# EAGLE design EM4095_base_circuit (EAGLE 7.5.0)
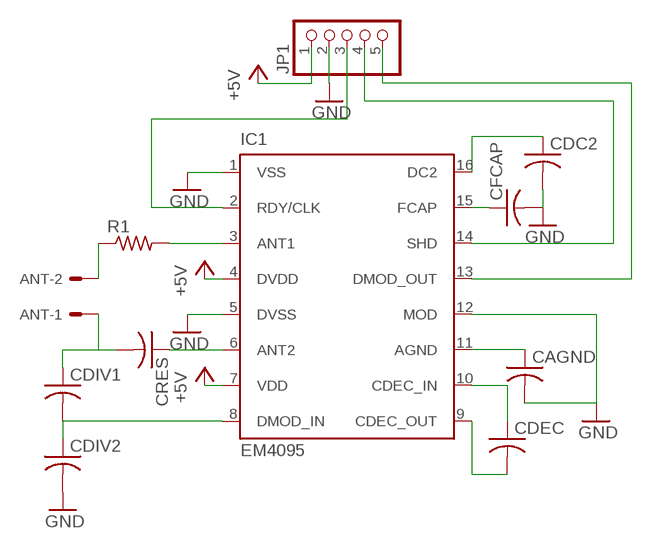
[diagram p0: schematic, sheet 1]

## Parts
ANT  KK-156-2  [KK-156-2]
CAGND  C-USC1206K  [C1206K]
CDC2  C-USC1206K  [C1206K]
CDEC  C-USC1206K  [C1206K]
CDIV1  C-USC1206K  [C1206K]
CDIV2  C-USC1206K  [C1206K]
CFCAP  C-USC1206K  [C1206K]
CRES  C-USC1206K  [C1206K]
IC1  EM4095  [SO16]
JP1  PINHD-1X5  [1X05]
R1  R-US_R1206  [R1206]

## Nets
+5V: IC1.4(DVDD) IC1.7(VDD) JP1.1
DMOD: IC1.13(DMOD_OUT) JP1.5
GND: CAGND.2 CDC2.2 CDIV2.2 CFCAP.2 IC1.1(VSS) IC1.5(DVSS) IC1.12(MOD) JP1.2
N$1: CFCAP.1 IC1.15(FCAP)
N$2: CAGND.1 IC1.11(AGND)
N$3: CRES.1 IC1.6(ANT2)
N$4: CDIV1.2 CDIV2.1 IC1.8(DMOD_IN)
N$5: ANT.1 CDIV1.1 CRES.2
N$6: ANT.2 R1.1
N$7: IC1.3(ANT1) R1.2
N$8: CDC2.1 IC1.16(DC2)
N$11: CDEC.2 IC1.9(CDEC_OUT)
N$12: CDEC.1 IC1.10(CDEC_IN)
RDY: IC1.2(RDY/CLK) JP1.3
SLP: IC1.14(SHD) JP1.4

## Library data of the parts
ANT = con-molex:KK-156-2: KK 156 HEADER Source: http://www.molex.com/pdm_docs/sd/026604100_sd.pdf; OC_FARNELL: unknown; OC_NEWARK: unknown
CAGND CDC2 CDEC CDIV1 CDIV2 CFCAP CRES = rcl:C-US: CAPACITOR, American symbol
IC1 = em-microelectronic:EM4095: Read/Write analog front end for 125kHz RFID Basestation Source: http://www.emmicroelectronic.com/webfiles/Product/RFID/DS/EM4095_DS.pdf
JP1 = pinhead:PINHD-1X5: PIN HEADER
R1 = rcl:R-US_: RESISTOR, American symbol

## Board
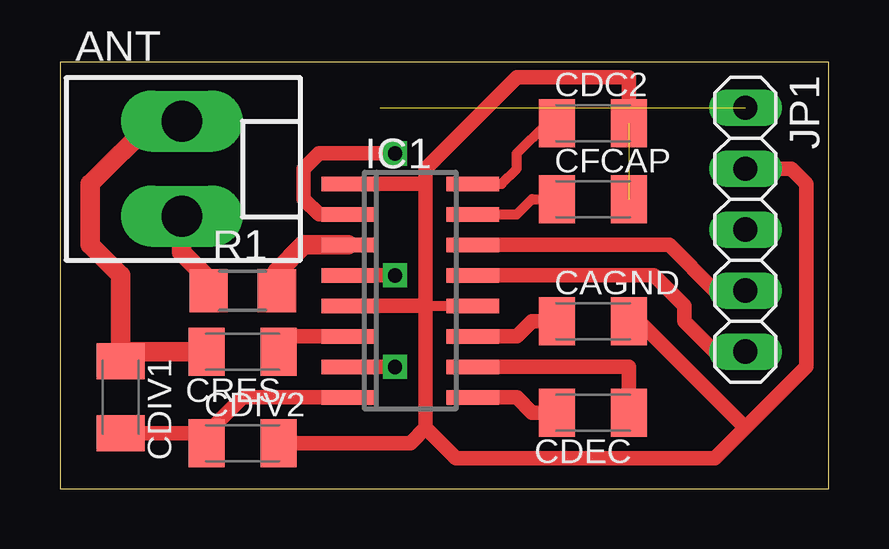
[diagram p1: board, top side]
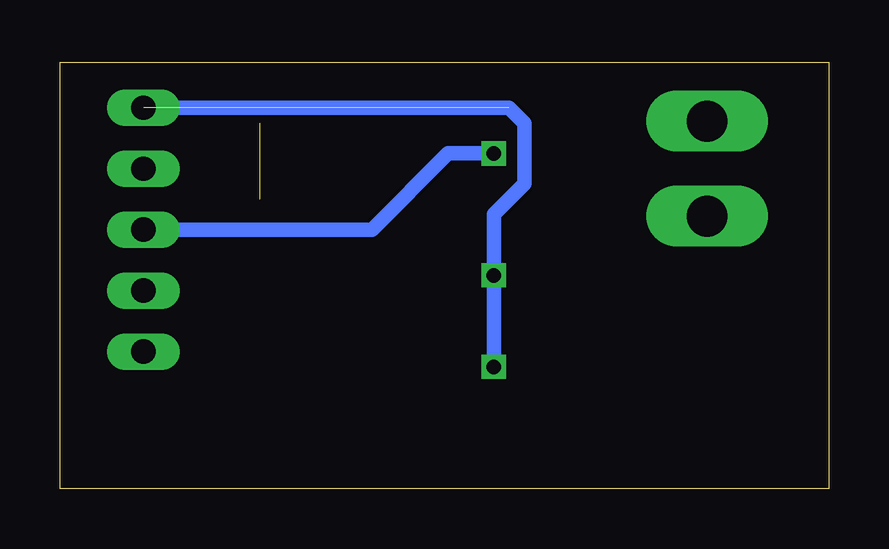
[diagram p2: board, bottom side, seen from below]

Size 32.05 x 17.77 mm. Coordinates in mm from the lower left corner, seen from the top.
Outline: 0,0 32.05,0 32.05,17.77 0,17.77 0,0
Copper layers (1*16): Top 0.035mm / dielectric 1.5mm / Bottom 0.035mm
Design rules "default": minimum track width 10mil, minimum drill 24mil, track to track 8mil, track to pad 8mil, pad to pad 8mil, via to via 8mil, smd to smd 8mil, copper to edge 40mil, drill to drill 8mil, minimum pad ring 10mil, minimum via ring 8mil, stop-mask expansion 4mil, vias tented up to drill 0mil, thermal gap 10mil

### Footprints (pad centres in the part's own frame; a part is rotated, then mirrored left to right if it is on the bottom)
KK-156-2 = drill 1.7 pad 2.184 long: 1 -1.98,0; 2 1.98,0
C1206K = smd 1.5 x 2: 1 -1.5,0; 2 1.5,0
SO16 = smd 0.6 x 2.2: 1 -4.445,-2.6; 2 -3.175,-2.6; 3 -1.905,-2.6; 4 -0.635,-2.6; 5 0.635,-2.6; 6 1.905,-2.6; 7 3.175,-2.6; 8 4.445,-2.6; 9 4.445,2.6; 10 3.175,2.6; 11 1.905,2.6; 12 0.635,2.6; 13 -0.635,2.6; 14 -1.905,2.6; 15 -3.175,2.6; 16 -4.445,2.6
1X05 = drill 1.016 long: 1 -5.08,0; 2 -2.54,0; 3 0,0; 4 2.54,0; 5 5.08,0
R1206 = smd 1.6 x 1.803: 1 -1.422,0; 2 1.422,0

### Placement (x,y rotation side)
ANT  5.08,13.34 270 top
CAGND  22.23,6.99 0 top
CDC2  22.23,15.24 0 top
CDEC  22.23,3.17 180 top
CDIV1  2.54,3.81 270 top
CDIV2  7.62,1.91 0 top
CFCAP  22.23,12.06 0 top
CRES  7.62,5.71 180 top
IC1  14.61,8.26 270 top
JP1  28.57,10.79 270 top
R1  7.62,8.26 0 top

### Tracks (layer width: path | path; a pad name or v marks a point on that pad's centre or on a via)
+5V  (via drill 0.6)  (1 unrouted)
  Top 0.61: IC1.4 v13.97,8.89 | v13.97,5.08 IC1.7
  Bottom 0.61: v13.97,5.08 v13.97,8.89 13.97,11.43 12.7,12.7 12.7,15.24 13.34,15.88 JP1.1
DMOD
  Top 0.61: IC1.13 24.77,8.89 26.04,7.62 26.04,6.99 27.3,5.71 JP1.5
GND  (1 unrouted)
  Top 0.406: 15.24,7.62 IC1.12
  Top 0.61: IC1.5 15.24,7.62 | IC1.1 15.24,12.7 | 15.24,12.7 15.24,7.62 | 15.24,2.54 15.24,7.62 | CAGND.2 24.13,6.99 28.57,2.54 | JP1.2 30.48,13.34 31.11,12.7 31.11,5.08 28.57,2.54 | 28.57,2.54 27.3,1.27 16.51,1.27 15.24,2.54 | CDC2.2 23.73,17.14 19.05,17.14 15.24,13.34 15.24,12.7 | CDIV2.2 14.61,1.91 15.24,2.54
N$1
  Top 0.406: IC1.15 19.05,11.43 19.68,12.06 CFCAP.1
N$2
  Top 0.61: IC1.11 19.05,6.35 19.68,6.99 CAGND.1
N$3
  Top 0.61: CRES.1 9.76,6.35 IC1.6
N$4
  Top 0.61: IC1.8 7.62,3.81 6.12,2.31 CDIV2.1 5.71,2.31 CDIV1.2
N$5
  Top 0.61: 2.94,5.71 CDIV1.1
  Top 0.813: ANT.1 3.88,15.31 1.27,12.7 1.27,10.16 2.54,8.89 CDIV1.1 | CRES.2 2.94,5.71
N$6
  Top 0.61: R1.1 6.2,8.74
  Top 0.813: 6.2,8.74 5.08,9.86 ANT.2
N$7
  Top 0.813: IC1.3 10.16,10.16 9.04,9.04 R1.2
N$8
  Top 0.406: IC1.16 18.41,12.7 19.05,13.34 19.05,13.97 20.32,15.24 CDC2.1
N$11
  Top 0.61: IC1.9 19.05,3.81 19.68,3.17 CDEC.2
N$12
  Top 0.61: IC1.10 23.73,5.08 CDEC.1
RDY  (via drill 0.6)
  Top 0.61: IC1.2 10.79,11.43 10.16,12.06 10.16,13.34 10.79,13.97 v13.97,13.97
  Bottom 0.61: v13.97,13.97 15.88,13.97 19.05,10.79 JP1.3
SLP
  Top 0.61: IC1.14 25.4,10.16 27.3,8.26 JP1.4